# EAGLE design untitled (EAGLE 8.7.1)
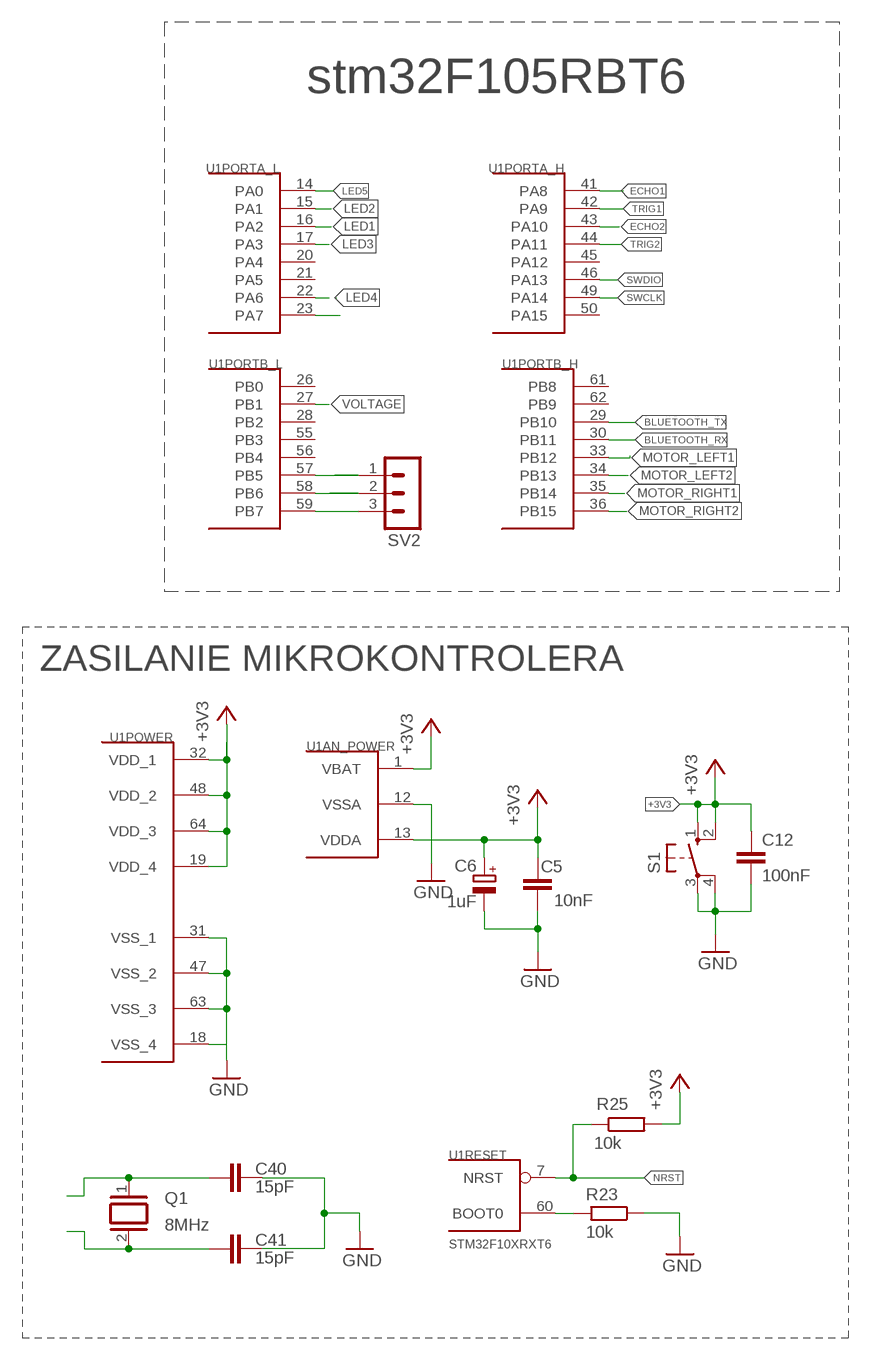
[diagram p0: schematic, sheet 1, part 1 of 2]
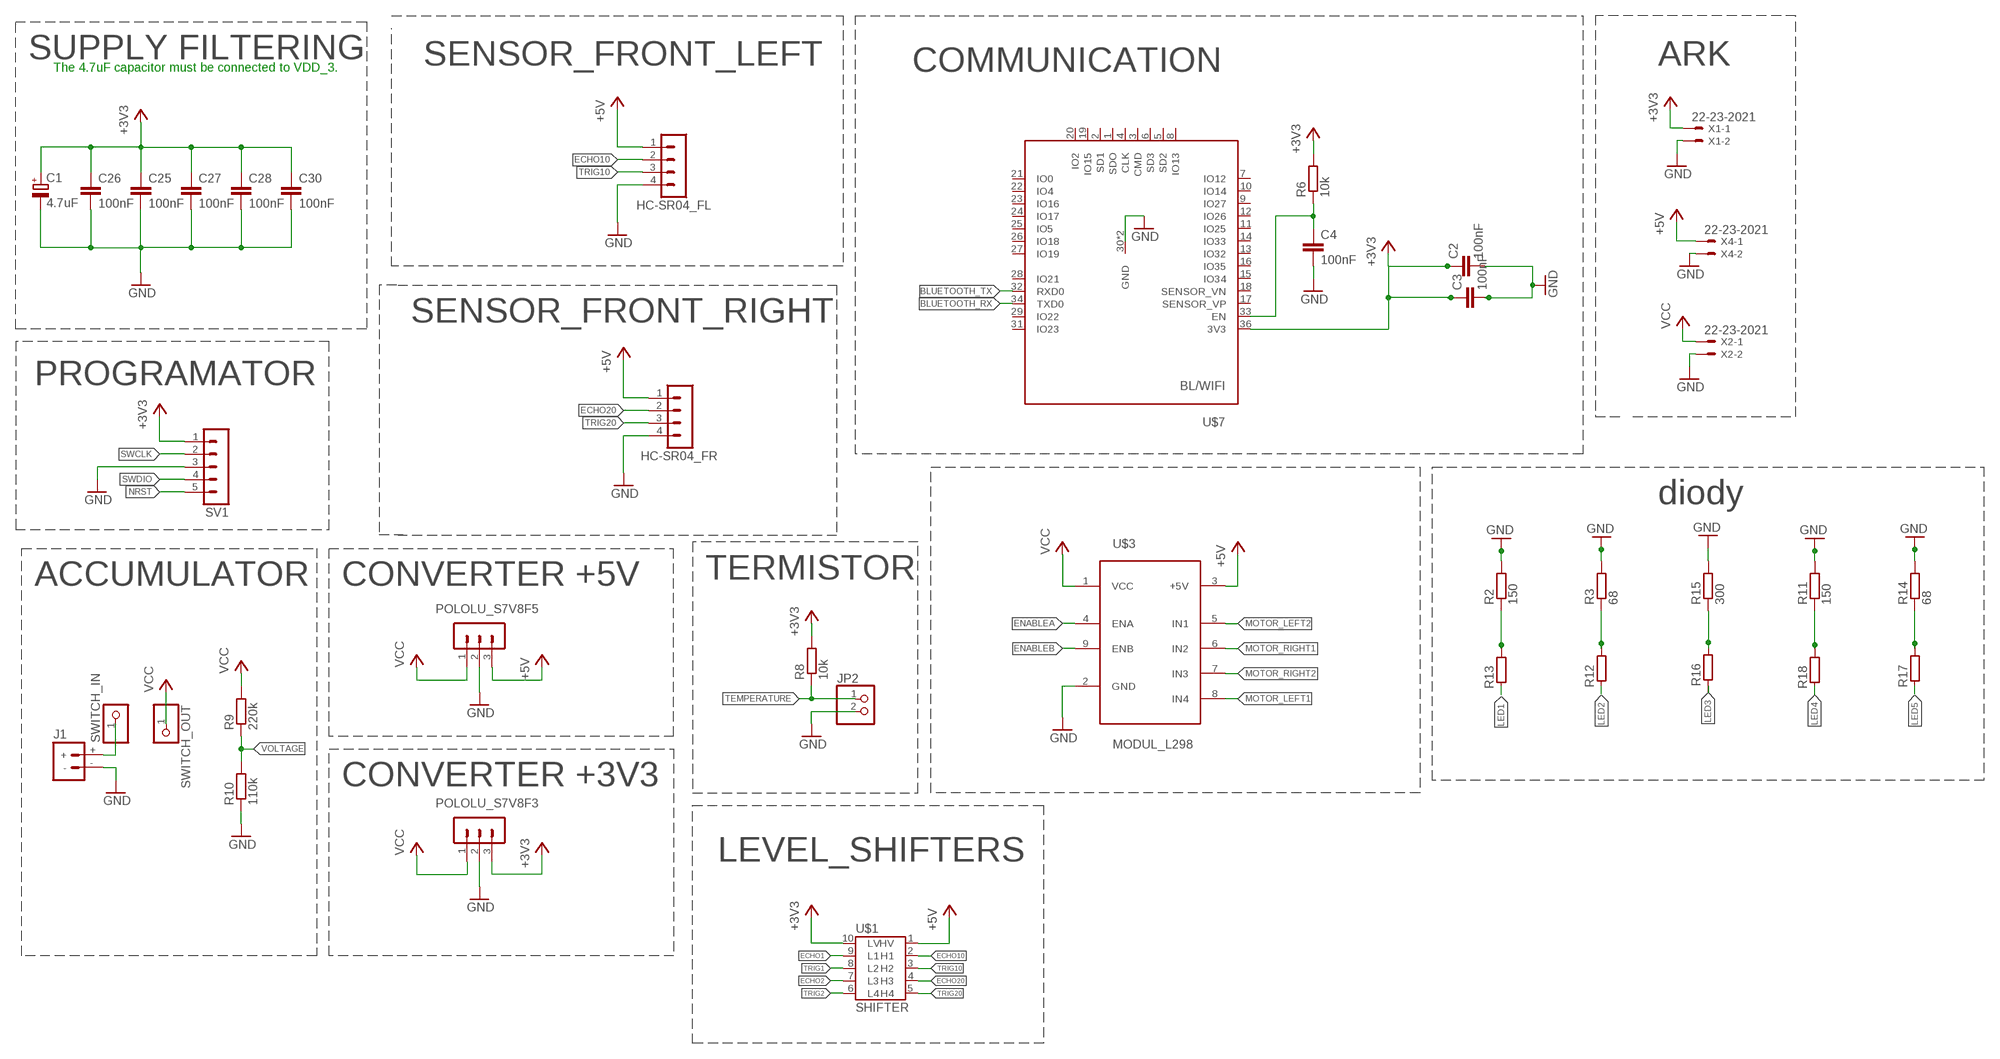
[diagram p1: schematic, sheet 1, part 2 of 2]

## Parts
C1  4.7uF  CPOL-EUA/3216-18R  [A/3216-18R]
C2  100nF  C-EUC0805  [C0805]
C3  100nF  C-EUC0805  [C0805]
C4  100nF  C-EUC0805  [C0805]
C5  10nF  C-EUC0805  [C0805]
C6  1uF  CPOL-EUB/3528-21W  [B/3528-21W]
C12  100nF  C-EUC0805  [C0805]
C25  100nF  C-EUC0805  [C0805]
C26  100nF  C-EUC0805  [C0805]
C27  100nF  C-EUC0805  [C0805]
C28  100nF  C-EUC0805  [C0805]
C30  100nF  C-EUC0805  [C0805]
C40  15pF  C-EUC0805  [C0805]
C41  15pF  C-EUC0805  [C0805]
HC-SR04_FL  MA04-1  [MA04-1]
HC-SR04_FR  MA04-1  [MA04-1]
J1  BATTERY_CONN_DEANS  [DEANS]
JP2  PINHD-1X2  [1X02]
POLOLU_S7V8F3  MA03-1  [MA03-1]
POLOLU_S7V8F5  MA03-1  [MA03-1]
Q1  8MHz  XTAL  [Q]
R2  150  R-EU_R0805  [R0805]
R3  68  R-EU_M0805  [M0805]
R6  10k  R-EU_M0805  [M0805]
R8  10k  R-EU_R0805  [R0805]
R9  220k  R-EU_R0805  [R0805]
R10  110k  R-EU_R0805  [R0805]
R11  150  R-EU_R0805  [R0805]
R12  R-EU_0204/5  [0204/5]
R13  R-EU_0204/5  [0204/5]
R14  68  R-EU_M0805  [M0805]
R15  300  R-EU_R0805  [R0805]
R16  R-EU_0204/5  [0204/5]
R17  R-EU_0204/5  [0204/5]
R18  R-EU_0204/5  [0204/5]
R23  10k  R-EU_R0805  [R0805]
R25  10k  R-EU_R0805  [R0805]
S1  TACT_SWITCH  [B3F-10XX]
SV1  MA05-1  [MA05-1]
SV2  MA03-1  [MA03-1]
SWITCH_IN  PINHD-1X1  [1X01]
SWITCH_OUT  PINHD-1X1  [1X01]
U1  STM32F10XRXT6  [TQFP64]
U$1  SHIFTER  [SHIFTER]
U$3  MODUL_L298  [MODUL_L298]
U$7  BL/WIFI  [BL/WIFI]
X1  22-23-2021  [22-23-2021]
X2  22-23-2021  [22-23-2021]
X4  22-23-2021  [22-23-2021]

## Nets
+3V3: C1.+ C2.1 C3.1 C5.2 C6.+ C12.1 C25.1 C26.1 C27.1 C28.1 C30.1 POLOLU_S7V8F3.3 R6.2 R8.2 R25.2 S1.1(S) S1.2(S1) SV1.1 U1.1(AN_POWER:VBAT) U1.13(AN_POWER:VDDA) U1.19(POWER:VDD_4) U1.32(POWER:VDD_1) U1.48(POWER:VDD_2) U1.64(POWER:VDD_3) U$1.10(LV) U$7.36(3V3) X1.1
+5V: HC-SR04_FL.1 HC-SR04_FR.1 POLOLU_S7V8F5.3 U$1.1(HV) U$3.3(+5V) X4.1
BLUETOOTH_RX: U1.30(PORTB_H:PB11) U$7.34(TXD0)
BLUETOOTH_TX: U1.29(PORTB_H:PB10) U$7.32(RXD0)
ECHO1: U1.41(PORTA_H:PA8) U$1.9(L1)
ECHO2: U1.43(PORTA_H:PA10) U$1.7(L3)
ECHO10: HC-SR04_FL.2 U$1.2(H1)
ECHO20: HC-SR04_FR.2 U$1.4(H3)
ENABLEA: U$3.4(ENA)
ENABLEB: U$3.9(ENB)
GND: C1.- C2.2 C3.2 C4.2 C5.1 C6.- C12.2 C25.2 C26.2 C27.2 C28.2 C30.2 C40.2 C41.2 HC-SR04_FL.4 HC-SR04_FR.4 J1.- JP2.2 POLOLU_S7V8F3.2 POLOLU_S7V8F5.2 R2.2 R3.2 R10.1 R11.2 R14.2 R15.2 R23.1 S1.3(P) S1.4(P1) SV1.3 U1.12(AN_POWER:VSSA) U1.18(POWER:VSS_4) U1.31(POWER:VSS_1) U1.47(POWER:VSS_2) U1.63(POWER:VSS_3) U$3.2(GND) U$7.30(GND) U$7.35(GND) X1.2 X2.2 X4.2
LED1: R13.1 U1.16(PORTA_L:PA2)
LED2: R12.1 U1.15(PORTA_L:PA1)
LED3: R16.1 U1.17(PORTA_L:PA3)
LED4: R18.1 U1.22(PORTA_L:PA6)
LED5: R17.1 U1.14(PORTA_L:PA0)
MOTOR_LEFT1: U1.33(PORTB_H:PB12) U$3.8(IN4)
MOTOR_LEFT2: U1.34(PORTB_H:PB13) U$3.5(IN1)
MOTOR_RIGHT1: U1.35(PORTB_H:PB14) U$3.6(IN2)
MOTOR_RIGHT2: U1.36(PORTB_H:PB15) U$3.7(IN3)
N$1: SV2.3 U1.59(PORTB_L:PB7)
N$2: R23.2 U1.60(RESET:BOOT0)
N$3: U1.23(PORTA_L:PA7)
N$11: C40.1 Q1.1
N$14: C41.1 Q1.2
N$66: SV2.2 U1.58(PORTB_L:PB6)
N$67: J1.+ SWITCH_IN.1
N$68: SV2.1 U1.57(PORTB_L:PB5)
N$69: C4.1 R6.1 U$7.33(EN)
N$70: R2.1 R13.2
N$71: R3.1 R12.2
N$74: R11.1 R18.2
N$75: R14.1 R17.2
N$76: R15.1 R16.2
NRST: R25.1 SV1.5 U1.7(RESET:NRST)
SWCLK: SV1.2 U1.49(PORTA_H:PA14)
SWDIO: SV1.4 U1.46(PORTA_H:PA13)
TEMPERATURE: JP2.1 R8.1
TRIG1: U1.42(PORTA_H:PA9) U$1.8(L2)
TRIG2: U1.44(PORTA_H:PA11) U$1.6(L4)
TRIG10: HC-SR04_FL.3 U$1.3(H2)
TRIG20: HC-SR04_FR.3 U$1.5(H4)
VCC: POLOLU_S7V8F3.1 POLOLU_S7V8F5.1 R9.2 SWITCH_OUT.1 U$3.1(VCC) X2.1
VOLTAGE: R9.1 R10.2 U1.27(PORTB_L:PB1)
Unconnected: U1.2(PORTC_H:PC13) U1.3(PORTC_H:PC14) U1.4(PORTC_H:PC15) U1.5(PORTD/OSC:PD0/OSC<=) U1.6(PORTD/OSC:PD1/OSC=>) U1.8(PORTC_L:PC0) U1.9(PORTC_L:PC1) U1.10(PORTC_L:PC2) U1.11(PORTC_L:PC3) U1.20(PORTA_L:PA4) U1.21(PORTA_L:PA5) U1.24(PORTC_L:PC4) U1.25(PORTC_L:PC5) U1.26(PORTB_L:PB0) U1.28(PORTB_L:PB2) U1.37(PORTC_L:PC6) U1.38(PORTC_L:PC7) U1.39(PORTC_H:PC8) U1.40(PORTC_H:PC9) U1.45(PORTA_H:PA12) U1.50(PORTA_H:PA15) U1.51(PORTC_H:PC10) U1.52(PORTC_H:PC11) U1.53(PORTC_H:PC12) U1.54(PORTD/OSC:PD2) U1.55(PORTB_L:PB3) U1.56(PORTB_L:PB4) U1.61(PORTB_H:PB8) U1.62(PORTB_H:PB9) U$7.1(SDO) U$7.2(SD1) U$7.3(CMD) U$7.4(CLK) U$7.5(SD2) U$7.6(SD3) U$7.7(IO12) U$7.8(IO13) U$7.9(IO27) U$7.10(IO14) U$7.11(IO25) U$7.12(IO26) U$7.13(IO32) U$7.14(IO33) U$7.15(IO34) U$7.16(IO35) U$7.17(SENSOR_VP) U$7.18(SENSOR_VN) U$7.19(IO15) U$7.20(IO2) U$7.21(IO0) U$7.22(IO4) U$7.23(IO16) U$7.24(IO17) U$7.25(IO5) U$7.26(IO18) U$7.27(IO19) U$7.28(IO21) U$7.29(IO22) U$7.31(IO23)

## Notes on the sheet
- SUPPLY FILTERING | SENSOR_FRONT_LEFT | ARK
- The 4.7uF capacitor must be connected to VDD_3. | COMMUNICATION
- stm32F105RBT6
- SENSOR_FRONT_RIGHT
- PROGRAMATOR
- ZASILANIE MIKROKONTROLERA
- diody
- ACCUMULATOR | CONVERTER +5V | TERMISTOR
- CONVERTER +3V3
- LEVEL_SHIFTERS

## Library data of the parts
C1 C6 = rcl:CPOL-EU: POLARIZED CAPACITOR, European symbol; SPICEPREFIX: C
C2-C5 C12 C25-C28 C30 C40 C41 = rcl:C-EU: CAPACITOR, European symbol; SPICEPREFIX: C
HC-SR04_FL HC-SR04_FR = con-lstb:MA04-1: PIN HEADER; OC_FARNELL: unknown; OC_NEWARK: unknown
J1 = SparkFun-Connectors:BATTERY_CONN: Battery Connectors Various footprints for battery connections SparkFun Products: Deans Connector -M/F Pair <https://www.sparkfun.com/products/11864>; SF_ID: PRT-11864
JP2 = pinhead:PINHD-1X2: PIN HEADER
POLOLU_S7V8F3 POLOLU_S7V8F5 SV2 = con-lstb:MA03-1: PIN HEADER; OC_FARNELL: unknown; OC_NEWARK: unknown
Q1 = special:XTAL: CRYSTAL
R2 R8-R13 R15-R18 R23 R25 = rcl:R-EU_: RESISTOR, European symbol
R3 R6 R14 = resistor:R-EU_: RESISTOR, European symbol
S1 = my_switch:TACT_SWITCH
SV1 = con-lstb:MA05-1: PIN HEADER; OC_FARNELL: unknown; OC_NEWARK: unknown
SWITCH_IN SWITCH_OUT = pinhead:PINHD-1X1: PIN HEADER
U1 = stm32:STM32F10XRXT6: STM32F101/103 64pin LQFP
U$1 = shifter:SHIFTER
U$3 = modul_L298:MODUL_L298
U$7 = Ble_WiFi:BL/WIFI
X1 X2 X4 = con-molex:22-23-2021: .100" (2.54mm) Center Header - 2 Pin; MF: MOLEX; MPN: 22-23-2021; OC_FARNELL: 1462926; OC_NEWARK: 25C3832

## Board
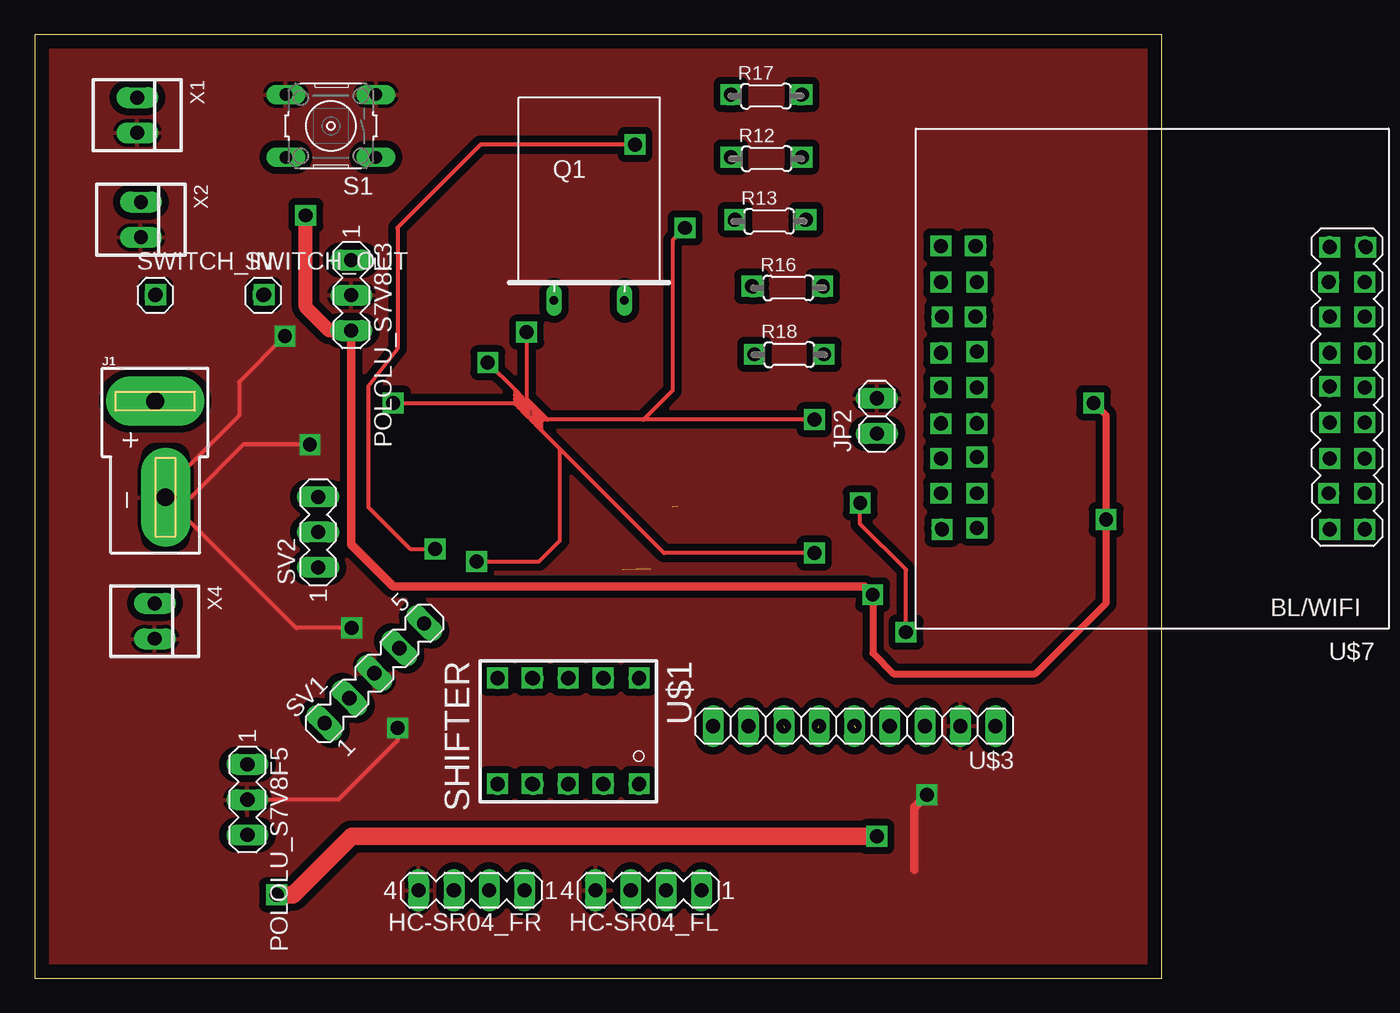
[diagram p2: board, top side]
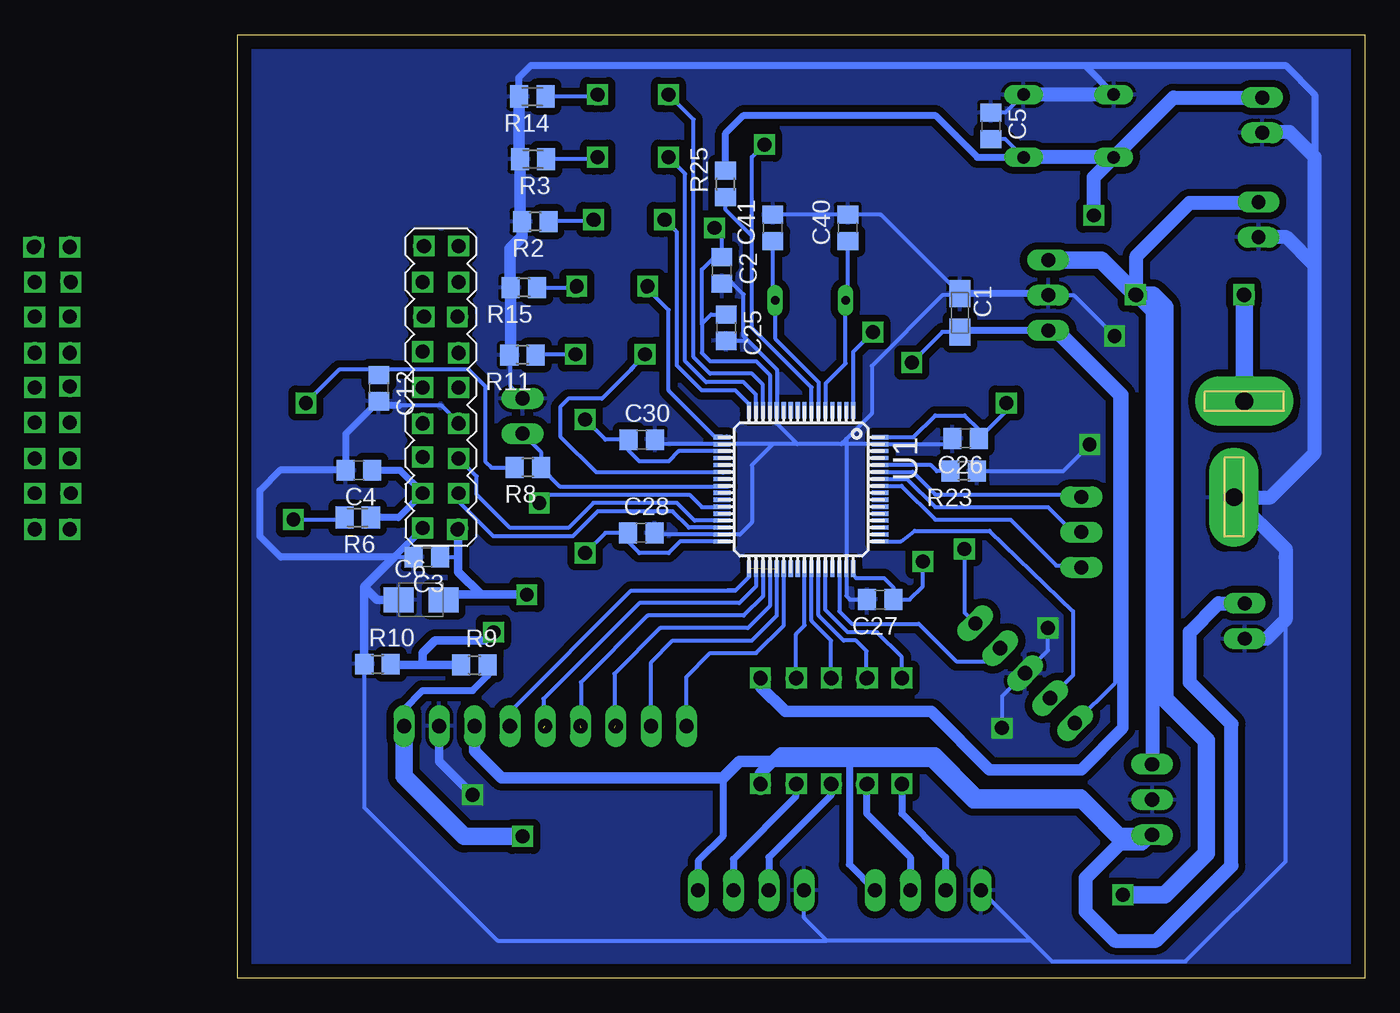
[diagram p3: board, bottom side, seen from below]

Size 81.1 x 67.9 mm. Coordinates in mm from the lower left corner, seen from the top.
Outline: 0,0 81.1,0 81.1,67.9 0,67.9 0,0
Copper layers (1*16): Top 0.035mm / dielectric 1.5mm / Bottom 0.035mm
Design rules "default": minimum track width 6mil, minimum drill 0.35mm, track to track 6mil, track to pad 6mil, pad to pad 6mil, via to via 6mil, smd to smd 6mil, copper to edge 40mil, drill to drill 6mil, minimum pad ring 10mil, minimum via ring 8mil, stop-mask expansion 4mil, vias tented up to drill 0mil, thermal gap 10mil

### Footprints (pad centres in the part's own frame; a part is rotated, then mirrored left to right if it is on the bottom)
A/3216-18R = smd 1.95 x 1.5: + 1.375,0; - -1.375,0
C0805 = smd 1.3 x 1.5: 1 -0.95,0; 2 0.95,0
B/3528-21W = smd 2.15 x 1.8: + 1.625,0; - -1.625,0
MA04-1 = drill 1.016 long: 1 -3.81,0; 2 -1.27,0; 3 1.27,0; 4 3.81,0
DEANS = drill 1.27 pad 3.556 long: + 0,0; - 0.737,-6.921
1X02 = drill 1.016 long: 1 -1.27,0; 2 1.27,0
MA03-1 = drill 1.016 long: 1 -2.54,0; 2 0,0; 3 2.54,0
Q = drill 0.61 long: 1 -2.54,-7.62; 2 2.54,-7.62
R0805 = smd 1.3 x 1.5: 1 -0.95,0; 2 0.95,0
M0805 = smd 1.3 x 1.6: 1 -0.95,0; 2 0.95,0
0204/5 = drill 0.813 octagon: 1 -2.54,0; 2 2.54,0
B3F-10XX = drill 0.9 long: 1 -3.251,2.261; 2 3.251,2.261; 3 -3.251,-2.261; 4 3.251,-2.261
MA05-1 = drill 1.016 long: 1 -5.08,0; 2 -2.54,0; 3 0,0; 4 2.54,0; 5 5.08,0
1X01 = drill 1.016 octagon: 1 0,0
TQFP64 = smd 1.2 x 0.3: 1 -5.7,3.75; 2 -5.7,3.25; 3 -5.7,2.75; 4 -5.7,2.25; 5 -5.7,1.75; 6 -5.7,1.25; 7 -5.7,0.75; 8 -5.7,0.25; 9 -5.7,-0.25; 10 -5.7,-0.75; 11 -5.7,-1.25; 12 -5.7,-1.75; 13 -5.7,-2.25; 14 -5.7,-2.75; 15 -5.7,-3.25; 16 -5.7,-3.75; 33 5.7,-3.75; 34 5.7,-3.25; 35 5.7,-2.75; 36 5.7,-2.25; 37 5.7,-1.75; 38 5.7,-1.25; 39 5.7,-0.75; 40 5.7,-0.25; 41 5.7,0.25; 42 5.7,0.75; 43 5.7,1.25; 44 5.7,1.75; 45 5.7,2.25; 46 5.7,2.75; 47 5.7,3.25; 48 5.7,3.75 | smd 0.3 x 1.2: 17 -3.75,-5.7; 18 -3.25,-5.7; 19 -2.75,-5.7; 20 -2.25,-5.7; 21 -1.75,-5.7; 22 -1.25,-5.7; 23 -0.75,-5.7; 24 -0.25,-5.7; 25 0.25,-5.7; 26 0.75,-5.7; 27 1.25,-5.7; 28 1.75,-5.7; 29 2.25,-5.7; 30 2.75,-5.7; 31 3.25,-5.7; 32 3.75,-5.7; 49 3.75,5.7; 50 3.25,5.7; 51 2.75,5.7; 52 2.25,5.7; 53 1.75,5.7; 54 1.25,5.7; 55 0.75,5.7; 56 0.25,5.7; 57 -0.25,5.7; 58 -0.75,5.7; 59 -1.25,5.7; 60 -1.75,5.7; 61 -2.25,5.7; 62 -2.75,5.7; 63 -3.25,5.7; 64 -3.75,5.7
SHIFTER = drill 1: 1 3.81,5.08; 2 3.81,2.54; 3 3.81,0; 4 3.81,-2.54; 5 3.81,-5.08; 6 -3.81,-5.08; 7 -3.81,-2.54; 8 -3.81,0; 9 -3.81,2.54; 10 -3.81,5.08
MODUL_L298 = drill 1.016 long: 1 0,0; 2 2.54,0; 3 5.08,0; 4 7.62,0; 5 10.16,0; 6 12.7,0; 7 15.24,0; 8 17.78,0; 9 20.32,0
BL/WIFI = drill 0.9: 1 4.25,-27.54; 2 1.71,-27.54; 3 4.25,-25; 4 1.71,-25; 5 4.25,-22.46; 6 1.71,-22.46; 7 4.25,-19.92; 8 1.71,-19.92; 9 4.25,-17.38; 10 1.71,-17.38; 11 4.25,-14.84; 12 1.71,-14.84; 13 4.25,-12.3; 14 1.71,-12.3; 15 4.25,-9.76; 16 1.71,-9.76; 17 4.25,-7.22; 18 1.71,-7.22; 19 29.65,-27.54; 20 32.19,-27.54; 21 29.65,-25; 22 32.19,-25; 23 29.65,-22.46; 24 32.19,-22.46; 25 29.65,-19.92; 26 32.19,-19.92; 27 29.65,-17.38; 28 32.19,-17.38; 29 29.65,-14.84; 30 32.19,-14.84; 31 29.65,-12.3; 32 32.19,-12.3; 33 29.65,-9.76; 34 32.19,-9.76; 35 29.65,-7.22; 36 32.19,-7.22
22-23-2021 = drill 1 long: 1 -1.27,0; 2 1.27,0

### Placement (x,y rotation side)
C1  29.13,47.88 270 bottom
C2  46.27,50.94 270 bottom
C3  67.5,30.3 180 bottom
C4  72.38,36.55 180 bottom
C5  26.9,61.34 270 bottom
C6  67.91,27.23 0 bottom
C12  70.95,42.47 270 bottom
C25  45.95,46.82 270 bottom
C26  28.73,38.85 180 bottom
C27  34.88,27.25 180 bottom
C28  52.07,32.05 0 bottom
C30  52.02,38.75 0 bottom
C40  37.2,54 90 bottom
C41  42.6,54 90 bottom
HC-SR04_FL  44.16,6.32 180 top
HC-SR04_FR  31.43,6.32 180 top
J1  8.67,41.53 0 top
JP2  60.6,40.46 90 top
POLOLU_S7V8F3  22.78,49.15 270 top
POLOLU_S7V8F5  15.3,12.85 270 top
Q1  39.9,56.4 0 top
R2  59.69,54.45 180 bottom
R3  59.85,58.95 180 bottom
R6  72.47,33.15 180 bottom
R8  60.23,36.75 180 bottom
R9  64.07,22.55 0 bottom
R10  71.04,22.6 0 bottom
R11  60.61,44.85 180 bottom
R12  52.67,58.98 0 top
R13  52.85,54.48 0 top
R14  59.91,63.45 180 bottom
R15  60.51,49.7 180 bottom
R16  54.23,49.68 0 top
R17  52.61,63.48 0 top
R18  54.29,44.88 0 top
R23  28.86,36.5 180 bottom
R25  46,57.16 90 bottom
S1  21.31,61.34 180 top
SV1  24.44,21.95 45 top
SV2  20.4,32.1 90 top
SWITCH_IN  8.67,49.15 0 top
SWITCH_OUT  16.43,49.15 0 top
U1  40.56,35.18 270 bottom
U$1  38.39,17.77 270 top
U$3  69.14,18.14 180 top
U$7  97.42,25.15 180 top
X1  7.38,62.11 270 top
X2  7.64,54.59 270 top
X4  8.64,25.7 270 top

### Tracks (layer width: path | path; a pad name or v marks a point on that pad's centre or on a via)
+3V3  (via drill 1)
  Top 0.305: v32.6,44.3 34.55,42.35 | 34.55,42.35 35.1,41.8 35.1,41.7 | 35.1,40.8 35.1,41.7 | 37.8,38.1 37.8,31.5 36.3,30 v31.8,30 | 37.8,38.1 36.45,39.45 | 36.45,39.45 36.15,39.75 | 36.15,39.75 35.85,40.05 | 35.85,40.05 35.7,40.2 | 35.7,40.2 35.55,40.35 | 35.55,40.35 35.25,40.65 | 35.25,40.65 35.1,40.8 | v56.1,30.6 45.3,30.6 37.8,38.1 | v56.1,40.2 43.8,40.2 | 43.8,40.2 36.9,40.2 | 36.9,40.2 36.6,40.2 36.45,40.35 | 36.45,40.35 36.3,40.5 | 36.3,40.5 36,40.8 | 36,40.8 35.85,40.95 | 35.85,40.95 35.55,41.25 | 35.55,41.25 35.25,41.55 | 35.25,41.55 35.1,41.7 | v25.8,41.4 34.8,41.4 | 34.8,41.4 35.1,41.7 | 35.25,41.55 35.25,40.65 | 36,40.8 36,40.5 35.85,40.35 | 35.85,40.35 35.7,40.2 | 36.3,40.5 36.15,40.35 | 36.15,40.35 35.85,40.05 | 36.15,40.35 36.15,39.75 | 36.45,40.35 36.45,39.45 | 35.85,40.95 35.85,40.35 | 35.55,41.25 35.55,40.35 | 34.8,41.4 34.8,41.1 | 34.8,41.1 35.1,40.8 | 34.55,42.35 34.55,42 | 34.55,42 34.55,41.7 | 34.55,41.7 34.55,41.35 34.8,41.1 | 35.1,41.7 34.85,41.7 34.55,42 | 34.8,41.4 34.8,41.45 34.55,41.7 | v35.4,46.5 35.4,41.7 36.9,40.2 | 77.1,40.5 77.1,33.3 v77.1,33 | 43.8,40.2 45.9,42.3 45.9,53.1 v46.8,54
  Top 0.508: v60.3,27.6 60.3,23.4 61.8,21.9 72,21.9 77.1,27 77.1,33.3 | v77.1,33 77.1,40.5 v76.2,41.4
  Top 0.61: POLOLU_S7V8F3.3 22.78,31.22 25.8,28.2 59.7,28.2 v60.3,27.6
  Top 1.016: POLOLU_S7V8F3.3 21.19,46.61 19.5,48.3 v19.5,54.9
  Bottom 0.305: C1.+ 30.4,46.5 v32.6,44.3 | U1.48 36.81,29.01 36.6,28.8 34.6,28.8 33.93,28.13 C27.1 32.75,27.25 31.8,28.2 v31.8,30 | U1.19 49.37,37.93 50.1,37.2 52.2,37.2 52.97,37.97 C30.1 54.65,38.75 v56.1,40.2 | U1.32 49.27,31.43 50.1,30.6 52.2,30.6 53.02,31.42 C28.1 54.65,32.05 v56.1,30.6 | 47.7,47.1 47.7,45 47.1,44.4 43.8,44.4 42.81,43.41 U1.13 | 47.7,47.1 47.03,47.77 C25.1 | U1.64 32.47,38.93 30.9,40.5 28.8,40.5 27.78,39.48 C26.1 25.8,40.83 v25.8,41.4 | U1.1 36.81,45.09 v35.4,46.5 | POLOLU_S7V8F3.3 18,41.83 18,21.21 SV1.1 | v76.2,41.4 73.8,43.8 71.33,43.8 | v77.1,33 73.57,33 R6.2 | 71.33,43.8 64.5,43.8 63.3,42.6 63.3,37.2 62.85,36.75 R8.2 | C12.1 71.33,43.8 | 47.7,47.1 47.7,51 46.8,51.9 46.79,51.89 C2.1 46.27,53.47 v46.8,54 | S1.1 25.87,60.39 C5.2 | C3.1 65.23,30.3
  Bottom 0.508: POLOLU_S7V8F3.3 29.02,46.61 C1.+ | R25.2 46,60.8 44.7,62.1 30.9,62.1 27.88,59.08 S1.1
  Bottom 0.61: v60.3,27.6 63.6,27.6 | U$7.36 65.23,30.3 65.23,29.23 63.6,27.6 | 63.6,27.6 65.91,27.6 C6.+
  Bottom 0.813: POLOLU_S7V8F3.3 22.01,46.61 17.4,42 17.4,18 20.4,15 27,15 31.2,19.2 41.7,19.2 43.47,20.97 U$1.10
  Bottom 1.016: v19.5,54.9 19.5,57.64 S1.2 | S1.2 13.76,63.38 X1.1 | S1.2 S1.1
+5V
  Bottom 0.508: 37.2,15.6 37.1,15.5 37.1,8.18 HC-SR04_FR.1 | 46.2,14.4 46.2,10.2 47.97,8.43 HC-SR04_FL.1
  Bottom 0.813: 17.51,10.31 20.4,13.2 27.9,13.2 30.9,16.2 42,16.2 43.47,14.73 U$1.1 | POLOLU_S7V8F5.3 16.01,9.6 17.4,9.6 20.4,12.6 28.2,12.6 31.2,15.6 37.2,15.6 45,15.6 46.2,14.4 62.1,14.4 64.06,16.36 U$3.3
  Bottom 1.016: 17.51,10.31 POLOLU_S7V8F5.3 16.99,10.31 20.1,7.2 20.1,4.8 18,2.7 15,2.7 9.6,8.1 9.6,18.3 12.6,21.3 12.6,24.9 10.53,26.97 X4.1
BLUETOOTH_RX
  Bottom 0.305: U1.30 48.63,32.43 49.8,33.6 55.2,33.6 57,31.8 62.7,31.8 65.23,34.33 U$7.34
BLUETOOTH_TX
  Bottom 0.305: U1.29 48.23,32.93 49.5,34.2 55.5,34.2 57.3,32.4 61.5,32.4 63.9,34.8 63.9,36.12 U$7.32 65.05,37.45
ECHO1
  Bottom 0.305: U$1.9 40.93,24.77 40.31,25.39 U1.41
ECHO2
  Bottom 0.305: U$1.7 35.85,23.55 36.6,24.3 37.5,24.3 39.31,26.11 U1.43
ECHO10
  Bottom 0.508: U$1.2 40.95,13.94 40.95,13.05 45.43,8.57 HC-SR04_FL.2
ECHO20
  Bottom 0.508: U$1.4 35.85,11.85 32.7,8.7 HC-SR04_FR.2
ENABLEA
  Bottom 0.305: U$3.4 61.52,19.18 52.8,27.9 45.3,27.9 | 45.3,27.9 45.9,27.9 | 44.31,28.89 45.3,27.9
ENABLEB
  Bottom 0.305: U$3.9 48.82,21.68 47.1,23.4 46.2,23.4 45.9,23.4 43.8,23.4 41.8,25.4 41.8,29.3
GND  (via drill 1)
  Top 0.305: v26.1,18 26.1,17.1 21.85,12.85 POLOLU_S7V8F5.2 | v19.8,38.4 15,38.4 11.21,34.61 J1.- | v18,46.2 14.7,42.9 14.7,40.5 9.41,35.21 J1.- | v22.8,25.2 18.82,25.2 J1.-
  Top 0.61: v64.2,13.2 63.3,12.3 63.3,7.8
  Bottom 0.305: 37.31,38.8 37.31,38.81 35.48,40.64 35.48,44.07 30.4,49.15 29.23,49.15 C1.- 34.83,54.95 C40.2 C41.2 | 37.31,38.8 U1.47 37.31,27.51 37.05,27.25 C27.2 | 37.31,38.8 37.68,38.43 | 37.68,38.43 40.83,38.43 | 40.83,38.43 42.6,38.43 | 42.6,38.43 U1.18 50.75,38.43 C30.2 | 37.68,38.43 U1.63 30.1,38.43 C26.2 | 42.6,38.43 44.1,36.93 44.1,32.8 44.97,31.93 U1.31 51,31.93 C28.2 | 46.21,45.61 C25.2 44.37,45.87 | 40.83,38.43 42.31,39.91 U1.12 42.31,43.79 42.3,43.8 44.37,45.87 | v26.1,18 26.1,20.29 SV1.3 22.8,23.59 v22.8,25.2 | R23.1 21.7,36.5 v19.8,38.4 | U$7.30 66.44,41.2 69.5,41.2 | JP2.2 61.46,42.59 61.46,44.95 | C12.2 70.63,41.2 70.5,41.2 | POLOLU_S7V8F3.2 20.95,49.15 v18,46.2 | 44.37,45.87 44.7,46.2 44.7,49.2 45.6,50.1 45.71,49.99 C2.2 | S1.3 25.87,62.29 C5.1 | 69.84,30.3 C3.2 | HC-SR04_FR.4 24,2.7 | 24,2.7 22.5,1.2 12.9,1.2 5.7,8.4 5.7,30.3 | 24,2.7 38.7,2.7 | HC-SR04_FL.4 40.35,4.35 38.7,2.7 | R10.1 71.99,12.29 62.4,2.7 38.7,2.7
  Bottom 0.508: POLOLU_S7V8F3.2 22.88,49.25 C1.- | 69.5,41.2 70.5,41.2 71.3,41.2 73.33,39.17 73.33,36.6 | 73.33,36.6 C4.2 | U$7.35 69.84,30.3 78,30.3 79.5,31.8 79.5,35.1 78,36.6 73.33,36.6 | R14.2 60.86,64.84 60,65.7 20.16,65.7 | 20.16,65.7 S1.4 | 20.16,65.7 5.7,65.7 3.6,63.6 3.6,59.1
  Bottom 0.61: R10.1 71.99,28.15 | 71.99,28.15 69.84,30.3 | C6.- 71.07,27.23 71.99,28.15 | U$3.2 66.6,15.6 v64.2,13.2
  Bottom 0.813: R14.2 60.86,59.01 R3.2 60.8,54.61 R2.2 60.64,53.36 61.5,52.5 61.5,49.74 R15.2 61.46,44.95 R11.2
  Bottom 1.016: X2.2 5.62,53.32 3.6,51.3 | 3.6,51.3 3.6,37.8 6.79,34.61 J1.- 5.7,30.9 5.7,30.3 5.7,25.8 7.07,24.43 X4.2 | 3.6,51.3 3.6,59.1 5.4,60.9 7.32,60.9 X1.2 | S1.4 S1.3
  pour Bottom (isolate 0.508): 0,67.8 81,67.8 81,0 0,0
  pour Top (isolate 0.508): 0,67.8 81,67.8 81,0 0,0
LED1  (via drill 1)
  Bottom 0.305: U1.16 44.31,41.31 45.3,42.3 47.7,42.3 49.5,44.1 49.5,53.7 v50.4,54.6 50.31,54.6 R13.1
LED2  (via drill 1)
  Bottom 0.305: U1.15 43.81,42.01 44.7,42.9 47.4,42.9 48.9,44.4 48.9,57.9 v50.1,59.1 50.1,58.98 R12.1
LED3
  Bottom 0.305: 46.26,39 46.8,39 50.1,42.3 50.1,48.09 R16.1 | U1.17 46.26,39 | 46.26,39 45.9,39
LED4
  Bottom 0.305: 46.26,36.4 55.3,36.4 57.9,39 57.9,41.1 57.3,41.7 54.9,41.7 52.8,43.8 | 52.65,43.95 52.8,43.8 | 52.8,43.8 52.8,43.83 R18.1 | U1.22 46.26,36.4 | 46.26,36.4 46.1,36.4
LED5  (via drill 1)
  Bottom 0.305: U1.14 43.31,42.71 44.1,43.5 47.1,43.5 48.3,44.7 48.3,61.8 v50.1,63.6 50.07,63.6 R17.1
MOTOR_LEFT1  (1 unrouted)
  Bottom 0.305: U$3.8 51.36,22.74 49.8,24.3 44.1,24.3 42.3,26.1 42.3,29.4
MOTOR_LEFT2  (1 unrouted)
  Bottom 0.305: U1.34 43.81,28.19 45,27 52.2,27 59.1,20.1 59.1,18
MOTOR_RIGHT1  (1 unrouted)
  Bottom 0.305: U1.35 43.31,27.49 44.7,26.1 51.6,26.1 56.4,21.3 56.4,18
MOTOR_RIGHT2  (1 unrouted)
  Bottom 0.305: U1.36 42.81,26.79 44.4,25.2 50.7,25.2 54,21.9 54,18
N$1
  Bottom 0.305: U1.59 32.53,36.43 30.9,34.8 20.1,34.8 | 20.1,34.8 19.8,34.8 | SV2.3 20.1,34.64 20.1,34.8
N$2
  Bottom 0.305: R23.2 30.8,36.5 31.23,36.93 U1.60
N$10  (via drill 1)
  other vias: 55.2,59.1
N$11
  Bottom 0.305: C40.1 37.2,48.94 Q1.1 37.36,44.24 38.8,42.8 38.8,40.6
N$12  (via drill 1)
  other vias: 55.2,63.6
N$13  (via drill 1)
  other vias: 55.5,54.6
N$14
  Bottom 0.305: C41.1 42.6,48.94 Q1.2 42.44,46.04 39.3,42.9 39.3,40.5
N$15  (via drill 1)
  other vias: 56.7,49.8
N$16  (via drill 1)
  other vias: 51.6,49.8
N$17  (via drill 1)
  other vias: 51.8,44.9
N$18  (via drill 1)
  other vias: 56.8,44.9
N$19  (via drill 1)
  other vias: 65.2,52.7
N$20  (via drill 1)
  other vias: 67.7,52.7
N$21  (via drill 1)
  other vias: 65.2,50.1
N$22  (via drill 1)
  other vias: 67.8,50.1
N$23  (via drill 1)
  other vias: 65.3,47.6
N$24  (via drill 1)
  other vias: 67.7,47.6
N$25  (via drill 1)
  other vias: 67.8,45.1
N$26  (via drill 1)
  other vias: 65.2,45
N$27  (via drill 1)
  other vias: 65.2,42.5
N$28  (via drill 1)
  other vias: 67.8,42.5
N$29  (via drill 1)
  other vias: 65.2,39.9
N$30  (via drill 1)
  other vias: 67.8,39.9
N$31  (via drill 1)
  other vias: 65.2,37.4
N$32  (via drill 1)
  other vias: 67.8,37.5
N$33  (via drill 1)
  other vias: 65.2,34.9
N$34  (via drill 1)
  other vias: 67.8,34.9
N$35  (via drill 1)
  other vias: 65.3,32.3
N$36  (via drill 1)
  other vias: 67.8,32.4
N$37  (via drill 1)
  other vias: 93.2,52.6
N$38  (via drill 1)
  other vias: 95.8,52.6
N$39  (via drill 1)
  other vias: 93.1,50.1
N$40  (via drill 1)
  other vias: 95.7,50.1
N$41  (via drill 1)
  other vias: 93.2,47.6
N$42  (via drill 1)
  other vias: 95.7,47.6
N$43  (via drill 1)
  other vias: 93.2,45
N$44  (via drill 1)
  other vias: 95.7,45
N$45  (via drill 1)
  other vias: 93.2,42.6
N$46  (via drill 1)
  other vias: 95.7,42.5
N$47  (via drill 1)
  other vias: 93.2,40
N$48  (via drill 1)
  other vias: 95.7,40
N$49  (via drill 1)
  other vias: 93.2,37.4
N$50  (via drill 1)
  other vias: 95.7,37.4
N$51  (via drill 1)
  other vias: 93.1,34.9
N$52  (via drill 1)
  other vias: 95.7,34.9
N$53  (via drill 1)
  other vias: 93.2,32.3
N$54  (via drill 1)
  other vias: 95.7,32.3
N$55  (via drill 1)
  other vias: 33.3,21.6
N$56  (via drill 1)
  other vias: 35.8,21.6
N$57  (via drill 1)
  other vias: 40.9,21.6
N$58  (via drill 1)
  other vias: 43.5,21.6
N$59  (via drill 1)
  other vias: 33.3,14
N$60  (via drill 1)
  other vias: 35.8,14
N$61  (via drill 1)
  other vias: 38.4,14
N$62  (via drill 1)
  other vias: 40.9,14
N$63  (via drill 1)
  other vias: 43.5,14
N$64  (via drill 1)
  other vias: 8.7,49.2
N$65  (via drill 1)
  other vias: 16.5,49.2
N$66
  Bottom 0.305: U1.58 32.93,35.93 30.9,33.9 22.8,33.9 21,32.1 SV2.2 20.1,32.1
N$67
  Bottom 1.27: J1.+ SWITCH_IN.1
N$68
  Bottom 0.305: U1.57 33.33,35.43 30.9,33 25.5,33 22.2,29.7 20.7,29.7 20.4,29.7 | 20.4,29.7 20.1,29.7 | SV2.1 20.4,29.7
N$69
  Bottom 0.508: C4.1 69.41,36.55 U$7.33 69.53,33.15 R6.1
N$70
  Bottom 0.305: R13.2 58.71,54.48 R2.1
N$71
  Bottom 0.305: R12.2 55.24,58.95 R3.1
N$74
  Bottom 0.305: R18.2 59.63,44.88 R11.1
N$75
  Bottom 0.305: R17.2 55.18,63.45 R14.1
N$76
  Bottom 0.305: R16.2 59.82,49.68 | 59.82,49.68 60,49.5 | 59.82,49.68 59.8,49.7 R15.1
NRST  (via drill 1)
  Top 0.305: v43.2,60 32.1,60 26.1,54 26.1,45.3 24,42.6 24,33.9 27,30.9 v28.8,30.9
  Bottom 0.305: U1.7 39.81,42.51 44.1,46.8 44.1,53.4 | R25.1 46,55.3 44.1,53.4 | 44.1,53.4 44.1,59.1 v43.2,60 | v28.8,30.9 28.8,26.31 SV1.5
SWCLK
  Bottom 0.305: SV1.2 21,21.8 21,26.4 27,32.2 32.4,32.2 33.37,31.43 U1.49
SWDIO
  Bottom 0.305: U1.46 37.81,26.41 36.9,25.5 32.1,25.5 29.4,22.8 27.18,22.8 SV1.4
TEMPERATURE
  Bottom 0.305: JP2.1 59.28,37.87 R8.1 57.93,35.4 45.8,35.4
TRIG1  (via drill 1)
  Bottom 0.305: U$1.8 v38.4,21.59 v38.4,21.6 38.4,24.3 39.81,25.71 U1.42
TRIG2
  Bottom 0.305: U$1.6 33.31,23.11 35.1,24.9 37.2,24.9 38.81,26.51 U1.44
TRIG10
  Bottom 0.508: U$1.3 38.39,13.21 42.89,8.71 HC-SR04_FL.3
TRIG20
  Bottom 0.508: U$1.5 33.31,11.85 30.16,8.7 HC-SR04_FR.3
VCC  (via drill 1)
  Top 1.27: v17.4,6 18.6,6 22.8,10.2 v60.6,10.2
  Bottom 0.508: U$3.1 69.14,19.36 67.8,20.7 64.2,20.7 63.12,21.78 R9.2
  Bottom 1.016: POLOLU_S7V8F5.1 15.3,48.02 SWITCH_OUT.1 16.43,51.97 12.6,55.8 7.7,55.8 X2.1
  Bottom 1.27: POLOLU_S7V8F3.1 18.97,51.69 SWITCH_OUT.1 15.25,49.15 14.4,48.3 14.4,20.1 11.4,17.1 11.4,9 14.4,6 v17.4,6 | v60.6,10.2 64.8,10.2 69.14,14.54 U$3.1
VOLTAGE  (via drill 1)  (1 unrouted)
  Top 0.305: v59.4,34.2 59.4,32.7 62.7,29.4 v62.7,24.9
  Bottom 0.305: v59.4,34.2 58.8,34.8 48.6,34.8 47.7,33.9 45.9,33.9
  Bottom 0.61: R9.1 67.8,22.55 | 67.8,22.55 70.04,22.55 R10.2 | 67.8,22.55 67.8,23.4 66.9,24.3 63.3,24.3 v62.7,24.9